# EAGLE schematic ambe_v1 (EAGLE 6.2)
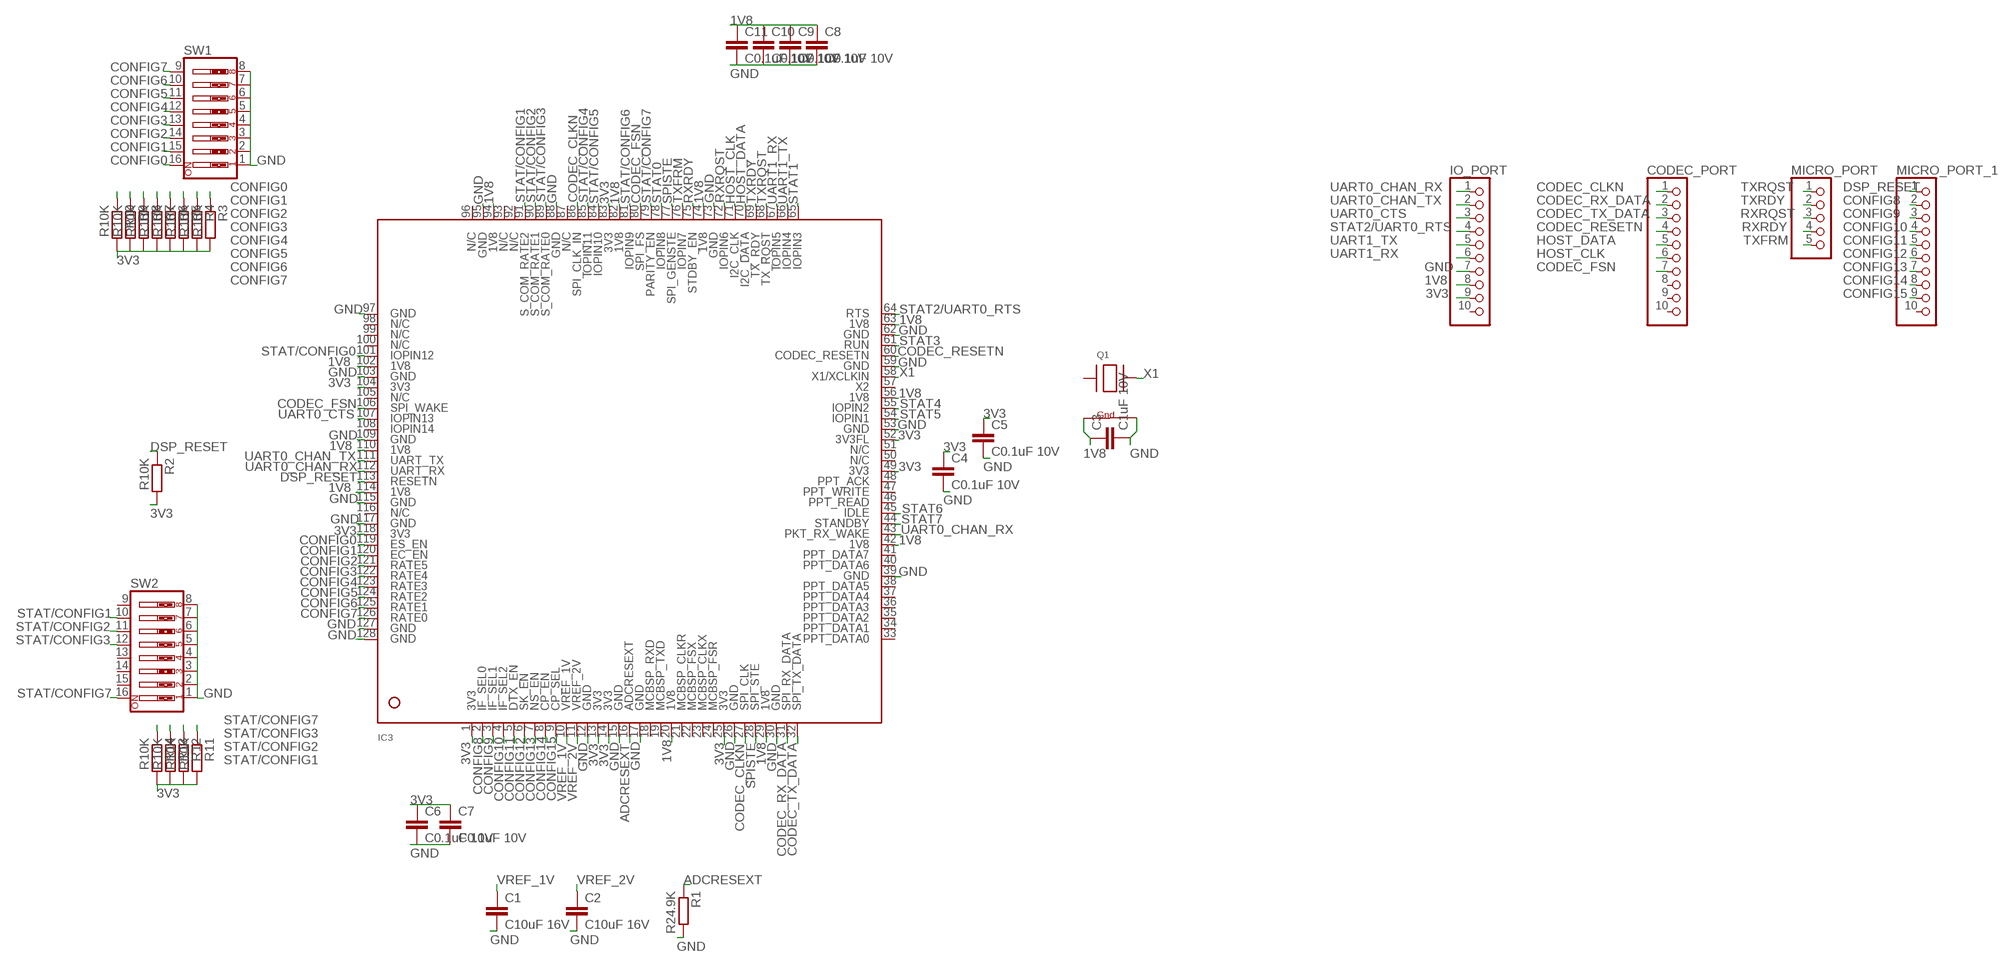
[diagram p0: schematic, sheet 1]

## Parts
C1  C10uF 16V  C-EUC0805  [C0805]
C2  C10uF 16V  C-EUC0805  [C0805]
C3  C1uF 10V  C-EUC0805  [C0805]
C4  C0.1uF 10V  C-EUC0805  [C0805]
C5  C0.1uF 10V  C-EUC0805  [C0805]
C6  C0.1uF 10V  C-EUC0805  [C0805]
C7  C0.1uF 10V  C-EUC0805  [C0805]
C8  C0.1uF 10V  C-EUC0805  [C0805]
C9  C0.1uF 10V  C-EUC0805  [C0805]
C10  C0.1uF 10V  C-EUC0805  [C0805]
C11  C0.1uF 10V  C-EUC0805  [C0805]
CODEC_PORT  PINHD-1X10  [1X10]
IC3  AMBE-3000LQFP-128  [LQFP-128]
IO_PORT  PINHD-1X10  [1X10]
MICRO_PORT  PINHD-1X5  [1X05]
MICRO_PORT_1  PINHD-1X10  [1X10]
Q1  XTAL-4-3225  [NX3225]
R1  R24.9K  R-EU_R0805  [R0805]
R2  R10K  R-EU_R0805  [R0805]
R3  R10K  R-EU_R0805  [R0805]
R4  R10K  R-EU_R0805  [R0805]
R5  R10K  R-EU_R0805  [R0805]
R6  R10K  R-EU_R0805  [R0805]
R7  R10K  R-EU_R0805  [R0805]
R8  R10K  R-EU_R0805  [R0805]
R9  R10K  R-EU_R0805  [R0805]
R10  R10K  R-EU_R0805  [R0805]
R11  R10K  R-EU_R0805  [R0805]
R12  R10K  R-EU_R0805  [R0805]
R13  R10K  R-EU_R0805  [R0805]
R14  R10K  R-EU_R0805  [R0805]
SW1  SW_DIP-8  [DIPSWITCH-08]
SW2  SW_DIP-8  [DIPSWITCH-08]

## Nets
1V8: C3.1 C8.1 C9.1 C10.1 C11.1 IC3.20(1V8) IC3.29(1V8) IC3.42(1V8) IC3.56(1V8) IC3.63(1V8) IC3.74(1V8) IC3.82(1V8) IC3.94(1V8) IC3.102(1V8) IC3.110(1V8) IC3.114(1V8) IO_PORT.8 Q1.4(G1)
3V3: C4.1 C5.1 C6.1 C7.1 IC3.1(3V3) IC3.13(3V3) IC3.14(3V3) IC3.25(3V3) IC3.49(3V3) IC3.52(3V3FL) IC3.83(3V3) IC3.104(3V3) IC3.118(3V3) IO_PORT.9 R2.2 R3.2 R4.2 R5.2 R6.2 R7.2 R8.2 R9.2 R10.2 R11.2 R12.2 R13.2 R14.2
ADCRESEXT: IC3.16(ADCRESEXT) R1.1
CODEC_CLKN: CODEC_PORT.1 IC3.27(SPI_CLK) IC3.86(SPI_CLK_IN)
CODEC_FSN: CODEC_PORT.7 IC3.80(SPI_FS) IC3.106(SPI_WAKE)
CODEC_RESETN: CODEC_PORT.4 IC3.60(CODEC_RESETN)
CODEC_RX_DATA: CODEC_PORT.2 IC3.31(SPI_RX_DATA)
CODEC_TX_DATA: CODEC_PORT.3 IC3.32(SPI_TX_DATA)
CONFIG0: IC3.119(ES_EN) R3.1 SW1.16
CONFIG1: IC3.120(EC_EN) R4.1 SW1.15
CONFIG2: IC3.121(RATE5) R5.1 SW1.14
CONFIG3: IC3.122(RATE4) R6.1 SW1.13
CONFIG4: IC3.123(RATE3) R7.1 SW1.12
CONFIG5: IC3.124(RATE2) R8.1 SW1.11
CONFIG6: IC3.125(RATE1) R9.1 SW1.10
CONFIG7: IC3.126(RATE0) R10.1 SW1.9
CONFIG8: IC3.2(IF_SEL0) MICRO_PORT_1.2
CONFIG9: IC3.3(IF_SEL1) MICRO_PORT_1.3
CONFIG10: IC3.4(IF_SEL2) MICRO_PORT_1.4
CONFIG11: IC3.5(DTX_EN) MICRO_PORT_1.5
CONFIG12: IC3.6(SK_EN) MICRO_PORT_1.6
CONFIG13: IC3.7(NS_EN) MICRO_PORT_1.7
CONFIG14: IC3.8(CP_EN) MICRO_PORT_1.8
CONFIG15: IC3.9(CP_SEL) MICRO_PORT_1.9
DSP_RESET: IC3.113(RESETN) MICRO_PORT_1.1 R2.1
GND: C1.2 C2.2 C3.2 C4.2 C5.2 C6.2 C7.2 C8.2 C9.2 C10.2 C11.2 IC3.12(GND) IC3.15(GND) IC3.17(GND) IC3.26(GND) IC3.30(GND) IC3.39(GND) IC3.53(GND) IC3.59(GND) IC3.62(GND) IC3.73(GND) IC3.88(GND) IC3.95(GND) IC3.97(GND) IC3.103(GND) IC3.109(GND) IC3.115(GND) IC3.117(GND) IC3.127(GND) IC3.128(GND) IO_PORT.7 Q1.2(G2) R1.2 SW1.1 SW1.2 SW1.3 SW1.4 SW1.5 SW1.6 SW1.7 SW1.8 SW2.1 SW2.2 SW2.3 SW2.4 SW2.5 SW2.6 SW2.7 SW2.8
HOST_CLK: CODEC_PORT.6 IC3.71(I2C_CLK)
HOST_DATA: CODEC_PORT.5 IC3.70(I2C_DATA)
RXRDY: IC3.75(STDBY_EN) MICRO_PORT.4
RXRQST: IC3.72(IOPIN6) MICRO_PORT.3
SPISTE: IC3.28(SPI_STE) IC3.77(SPI_GENSTE)
STAT0: IC3.78(IOPIN8)
STAT1: IC3.65(IOPIN3)
STAT2/UART0_RTS: IC3.64(RTS) IO_PORT.4
STAT3: IC3.61(RUN)
STAT4: IC3.55(IOPIN2)
STAT5: IC3.54(IOPIN1)
STAT6: IC3.45(IDLE)
STAT7: IC3.44(STANDBY)
STAT/CONFIG0: IC3.101(IOPIN12)
STAT/CONFIG1: IC3.91(S_COM_RATE2) R14.1 SW2.10
STAT/CONFIG2: IC3.90(S_COM_RATE1) R13.1 SW2.11
STAT/CONFIG3: IC3.89(S_COM_RATE0) R12.1 SW2.12
STAT/CONFIG4: IC3.85(IOPIN11)
STAT/CONFIG5: IC3.84(IOPIN10)
STAT/CONFIG6: IC3.81(IOPIN9)
STAT/CONFIG7: IC3.79(PARITY_EN) R11.1 SW2.16
TXFRM: IC3.76(IOPIN7) MICRO_PORT.5
TXRDY: IC3.69(TX_RDY) MICRO_PORT.2
TXRQST: IC3.68(TX_RQST) MICRO_PORT.1
UART0_CHAN_RX: IC3.43(PKT_RX_WAKE) IC3.112(UART_RX) IO_PORT.1
UART0_CHAN_TX: IC3.111(UART_TX) IO_PORT.2
UART0_CTS: IC3.107(IOPIN13) IO_PORT.3
UART1_RX: IC3.67(IOPIN5) IO_PORT.6
UART1_TX: IC3.66(IOPIN4) IO_PORT.5
VREF_1V: C1.1 IC3.10(VREF_1V)
VREF_2V: C2.1 IC3.11(VREF_2V)
X1: IC3.58(X1/XCLKIN) Q1.3(X2)
Unconnected: CODEC_PORT.8 CODEC_PORT.9 CODEC_PORT.10 IC3.18(MCBSP_RXD) IC3.19(MCBSP_TXD) IC3.21(MCBSP_CLKR) IC3.22(MCBSP_FSX) IC3.23(MCBSP_CLKX) IC3.24(MCBSP_FSR) IC3.33(PPT_DATA0) IC3.34(PPT_DATA1) IC3.35(PPT_DATA2) IC3.36(PPT_DATA3) IC3.37(PPT_DATA4) IC3.38(PPT_DATA5) IC3.40(PPT_DATA6) IC3.41(PPT_DATA7) IC3.46(PPT_READ) IC3.47(PPT_WRITE) IC3.48(PPT_ACK) IC3.50(N/C) IC3.51(N/C) IC3.57(X2) IC3.87(N/C) IC3.92(N/C) IC3.93(N/C) IC3.96(N/C) IC3.98(N/C) IC3.99(N/C) IC3.100(N/C) IC3.105(N/C) IC3.108(IOPIN14) IC3.116(N/C) IO_PORT.10 MICRO_PORT_1.10 Q1.1(X1) SW2.9 SW2.13 SW2.14 SW2.15

## Library data of the parts
C1-C11 = resistor:C-EU: CAPACITOR, European symbol
CODEC_PORT IO_PORT MICRO_PORT_1 = pinhead:PINHD-1X10: PIN HEADER
IC3 = AMBE-3000:AMBE-3000
MICRO_PORT = pinhead:PINHD-1X5: PIN HEADER
Q1 = adafruit:XTAL-4: Classic 4-pin 3.2 x 2.5mm crystal
R1-R14 = resistor:R-EU_: RESISTOR, European symbol
SW1 SW2 = SparkFun-Electromechanical:SW_DIP-8: DIP Switch 8 Position Spark Fun Electronics SKU : COM-08034